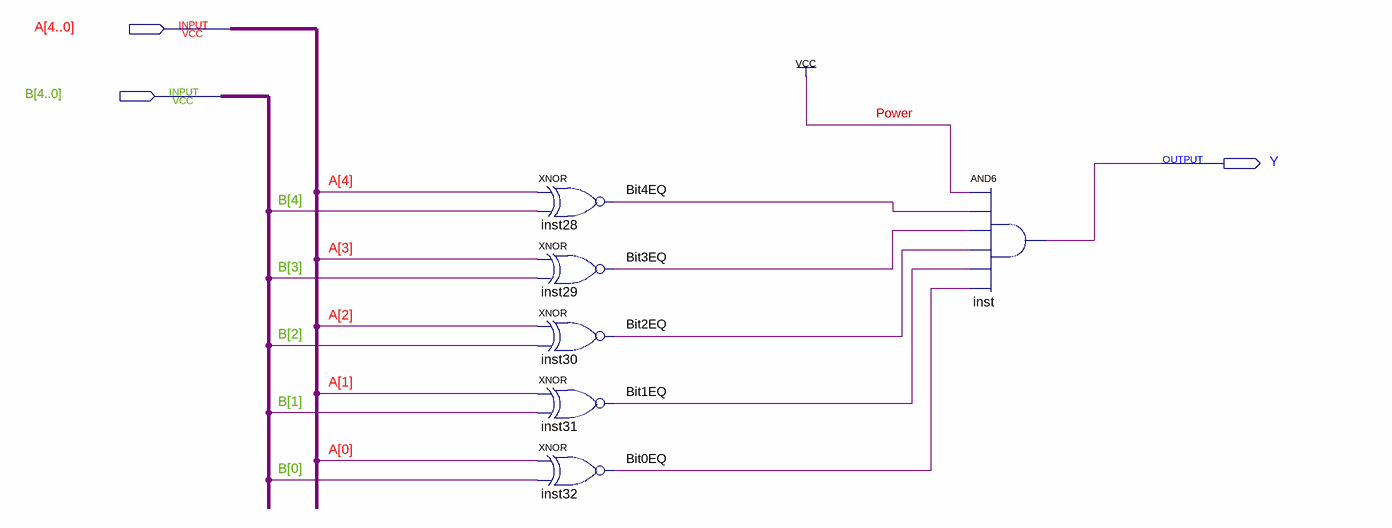
[diagram p0: schematic sheet]
// Quartus schematic EQ_5.bdf as structural Verilog: 6 symbols, 3 pins
module EQ_5 (
  input  [4:0] A,
  input  [4:0] B,
  output Y
);

  wire Bit0EQ, Bit1EQ, Bit2EQ, Bit3EQ, Bit4EQ;

  xnor inst28 (Bit4EQ, A[4], B[4]);
  xnor inst29 (Bit3EQ, A[3], B[3]);
  xnor inst30 (Bit2EQ, A[2], B[2]);
  xnor inst31 (Bit1EQ, A[1], B[1]);
  xnor inst32 (Bit0EQ, A[0], B[0]);
  and inst (Y, 1'b1, Bit4EQ, Bit3EQ, Bit2EQ, Bit1EQ, Bit0EQ);
endmodule
